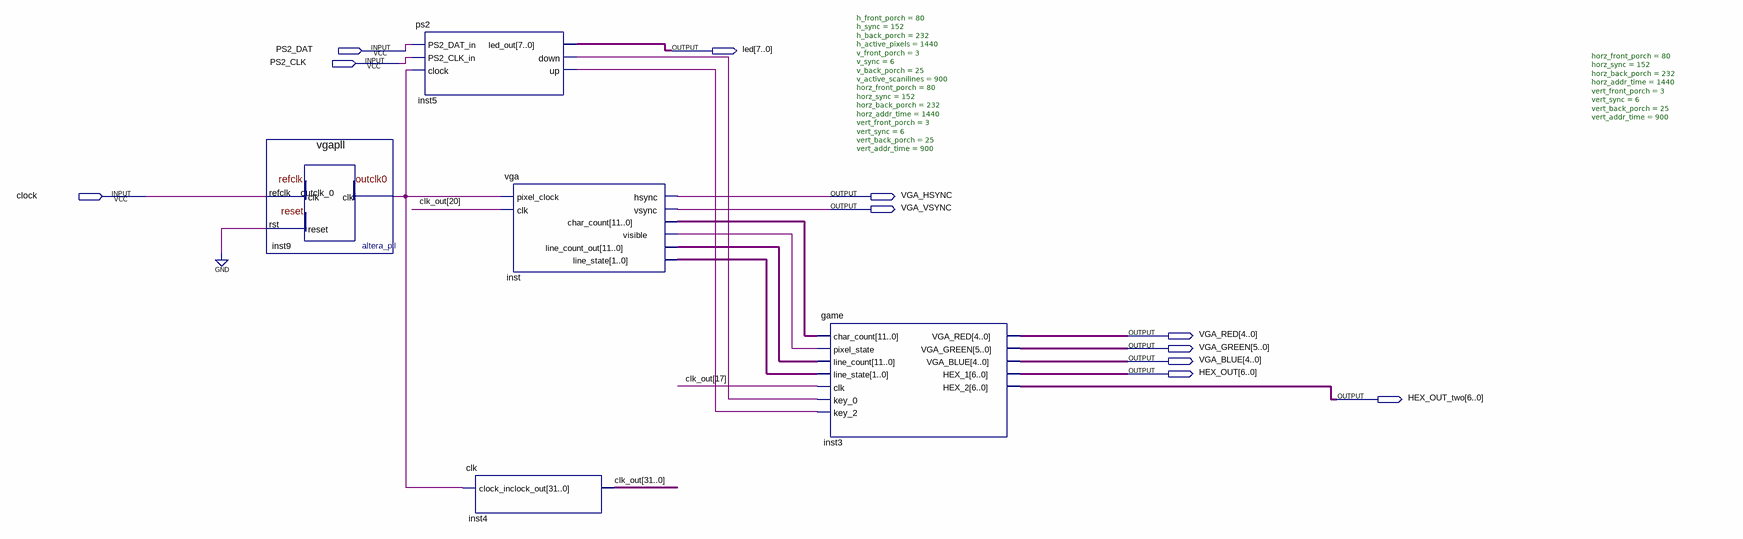
[diagram p0: schematic sheet]
// Quartus schematic main.bdf as structural Verilog: 5 symbols, 11 pins
module main (
  input  PS2_DAT,
  input  PS2_CLK,
  input  clock,
  output [7:0] led,
  output VGA_HSYNC,
  output VGA_VSYNC,
  output [4:0] VGA_RED,
  output [5:0] VGA_GREEN,
  output [4:0] VGA_BLUE,
  output [6:0] HEX_OUT,
  output [6:0] HEX_OUT_two
);

  wire inst5_down, inst5_up, inst9_outclk_0, inst_visible;
  wire [1:0] inst_line_state;
  wire [11:0] inst_char_count, inst_line_count_out;
  wire [31:0] clk_out;

  vgapll inst9 (.refclk(clock), .rst(1'b0), .outclk_0(inst9_outclk_0));
  ps2 inst5 (
    .PS2_DAT_in(PS2_DAT), .PS2_CLK_in(PS2_CLK), .clock(inst9_outclk_0), .led_out(led), .down(inst5_down),
    .up(inst5_up));
  clk inst4 (.clock_in(inst9_outclk_0), .clock_out(clk_out));
  vga #(.h_front_porch(80), .h_sync(152), .h_back_porch(232), .h_active_pixels(1440), .v_front_porch(3), .v_sync(6), .v_back_porch(25), .v_active_scanilines(900), .horz_front_porch(80), .horz_sync(152), .horz_back_porch(232), .horz_addr_time(1440), .vert_front_porch(3), .vert_sync(6), .vert_back_porch(25), .vert_addr_time(900)) inst (
    .pixel_clock(inst9_outclk_0), .clk(clk_out[20]), .hsync(VGA_HSYNC), .vsync(VGA_VSYNC),
    .char_count(inst_char_count), .visible(inst_visible), .line_count_out(inst_line_count_out),
    .line_state(inst_line_state));
  game #(.horz_front_porch(80), .horz_sync(152), .horz_back_porch(232), .horz_addr_time(1440), .vert_front_porch(3), .vert_sync(6), .vert_back_porch(25), .vert_addr_time(900)) inst3 (
    .char_count(inst_char_count), .pixel_state(inst_visible), .line_count(inst_line_count_out),
    .line_state(inst_line_state), .clk(clk_out[17]), .key_0(inst5_down), .key_2(inst5_up), .VGA_RED(VGA_RED),
    .VGA_GREEN(VGA_GREEN), .VGA_BLUE(VGA_BLUE), .HEX_1(HEX_OUT), .HEX_2(HEX_OUT_two));
endmodule
